# EAGLE design pcb (EAGLE 8.0.1)
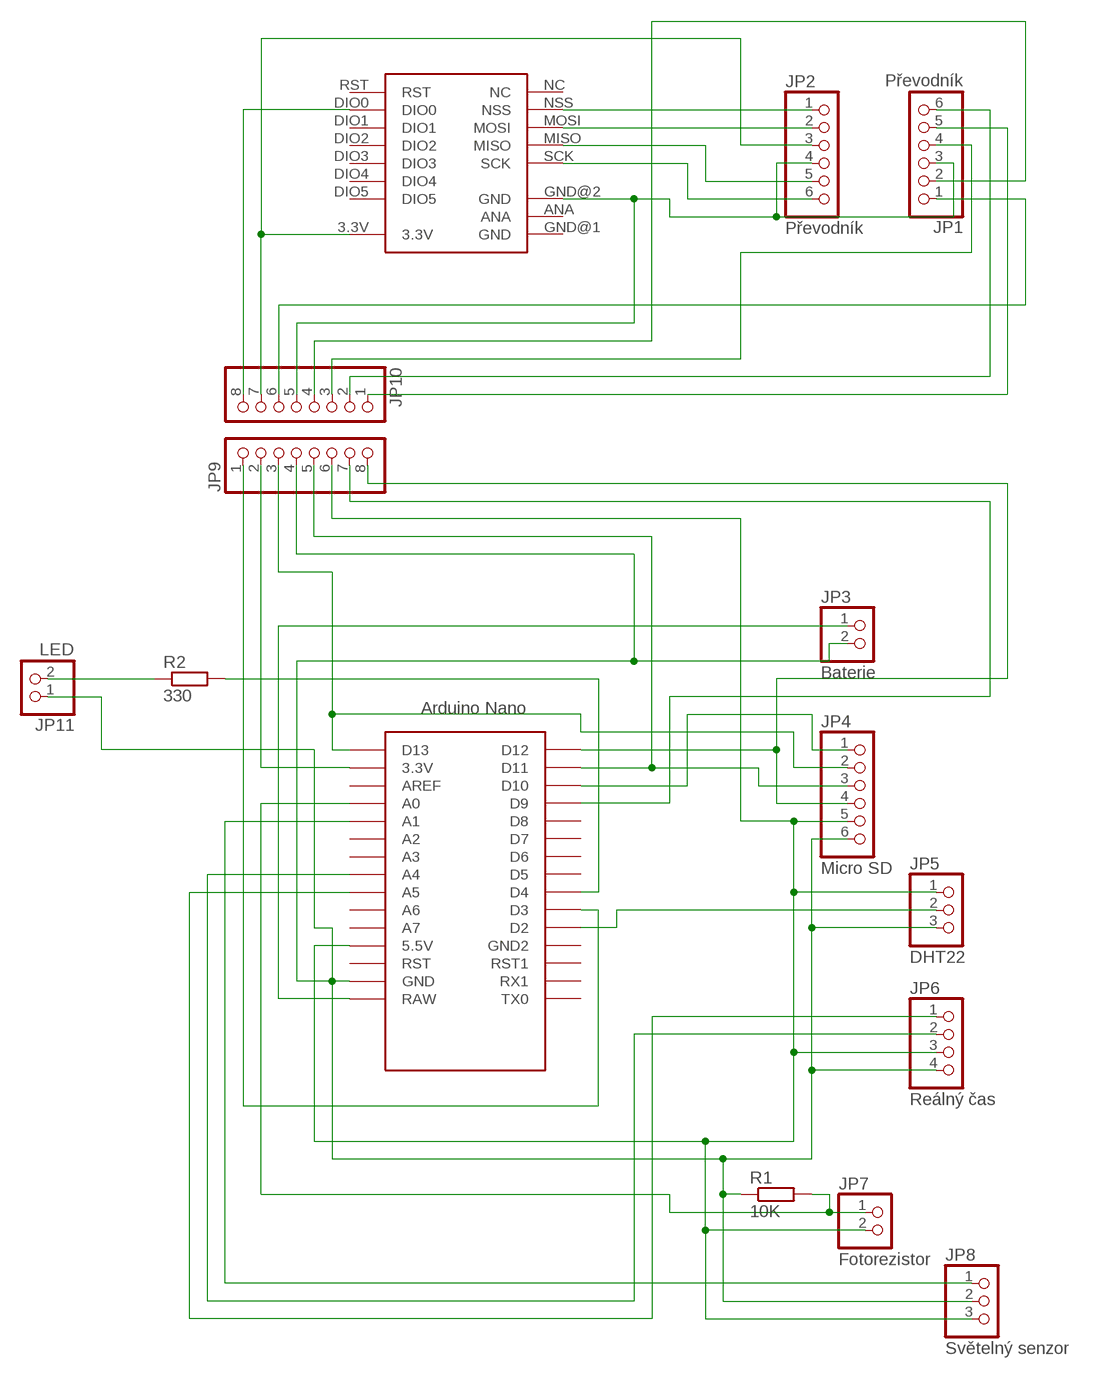
[diagram p0: schematic, sheet 1]

## Parts
JP1  Převodník  PINHD-1X6  [1X06]
JP2  Převodník  PINHD-1X6  [1X06]
JP3  Baterie  PINHD-1X2  [1X02]
JP4  Micro SD  PINHD-1X6  [1X06]
JP5  DHT22  PINHD-1X3  [1X03]
JP6  Reálný čas  PINHD-1X4  [1X04]
JP7  Fotorezistor  PINHD-1X2  [1X02]
JP8  Světelný senzor  PINHD-1X3  [1X03]
JP9  PINHD-1X8  [1X08]
JP10  PINHD-1X8  [1X08]
JP11  LED  PINHD-1X2  [1X02]
R1  10K  R-EU_0204/7  [0204/7]
R2  330  R-EU_0204/7  [0204/7]
RFM69  RFM69  [20X16BOARD]
U$1  NANO  [NANO]

## Nets
N$1: JP4.5 JP5.1 JP6.3 JP7.2 JP8.3 JP9.6 U$1.5V(5.5V)
N$2: JP3.2 JP4.6 JP5.3 JP6.4 JP8.2 JP9.4 JP11.1 R1.1 U$1.GND
N$3: JP4.4 JP9.8 U$1.D12
N$4: JP1.2 JP10.4
N$5: JP1.1 JP10.6
N$6: JP4.1 U$1.D10
N$7: JP3.1 U$1.RAW
N$8: JP5.2 U$1.D2
N$9: JP2.5 RFM69.MISO
N$10: JP2.6 RFM69.SCK
N$11: JP2.2 RFM69.MOSI
N$12: JP2.1 RFM69.NSS
N$13: JP2.3 JP10.7 RFM69.3.3V
N$14: JP9.1 U$1.D3
N$15: JP8.1 U$1.A1
N$16: JP7.1 R1.2 U$1.A0
N$17: JP9.7 U$1.D9
N$18: JP6.2 U$1.A4
N$19: JP6.1 U$1.A5
N$20: JP10.8 RFM69.DIO0
N$21: JP9.2 U$1.3.3V
N$22: JP4.2 JP9.3 U$1.D13
N$23: JP1.3 JP2.4 JP10.5 RFM69.GND@2(GND)
N$24: JP4.3 JP9.5 U$1.D11
N$25: JP1.4 JP10.3
N$26: JP1.6 JP10.2
N$27: JP1.5 JP10.1
N$29: JP11.2 R2.1
N$30: R2.2 U$1.D4
Unconnected: RFM69.ANA RFM69.DIO1 RFM69.DIO2 RFM69.DIO3 RFM69.DIO4 RFM69.DIO5 RFM69.RST U$1.A2 U$1.A3 U$1.A6 U$1.A7 U$1.AREF U$1.D5 U$1.D6 U$1.D7 U$1.D8 U$1.GND1(GND2) U$1.ICSP1 U$1.ICSP2 U$1.ICSP3 U$1.ICSP4 U$1.ICSP5 U$1.ICSP6 U$1.RST U$1.RST1 U$1.RX1 U$1.TX0

## Power pins joined to a net without a drawn wire
GND: RFM69.GND@1(GND)
NC: RFM69.NC

## Library data of the parts
JP1 JP2 JP4 = pinhead:PINHD-1X6: PIN HEADER
JP3 JP7 JP11 = pinhead:PINHD-1X2: PIN HEADER
JP5 JP8 = pinhead:PINHD-1X3: PIN HEADER
JP6 = pinhead:PINHD-1X4: PIN HEADER
JP9 JP10 = pinhead:PINHD-1X8: PIN HEADER
R1 R2 = resistor:R-EU_: RESISTOR, European symbol
RFM69 = RFM69mod:RFM69: RFM69 module
U$1 = Arduino-clone:NANO: Arduino Nano

## Board
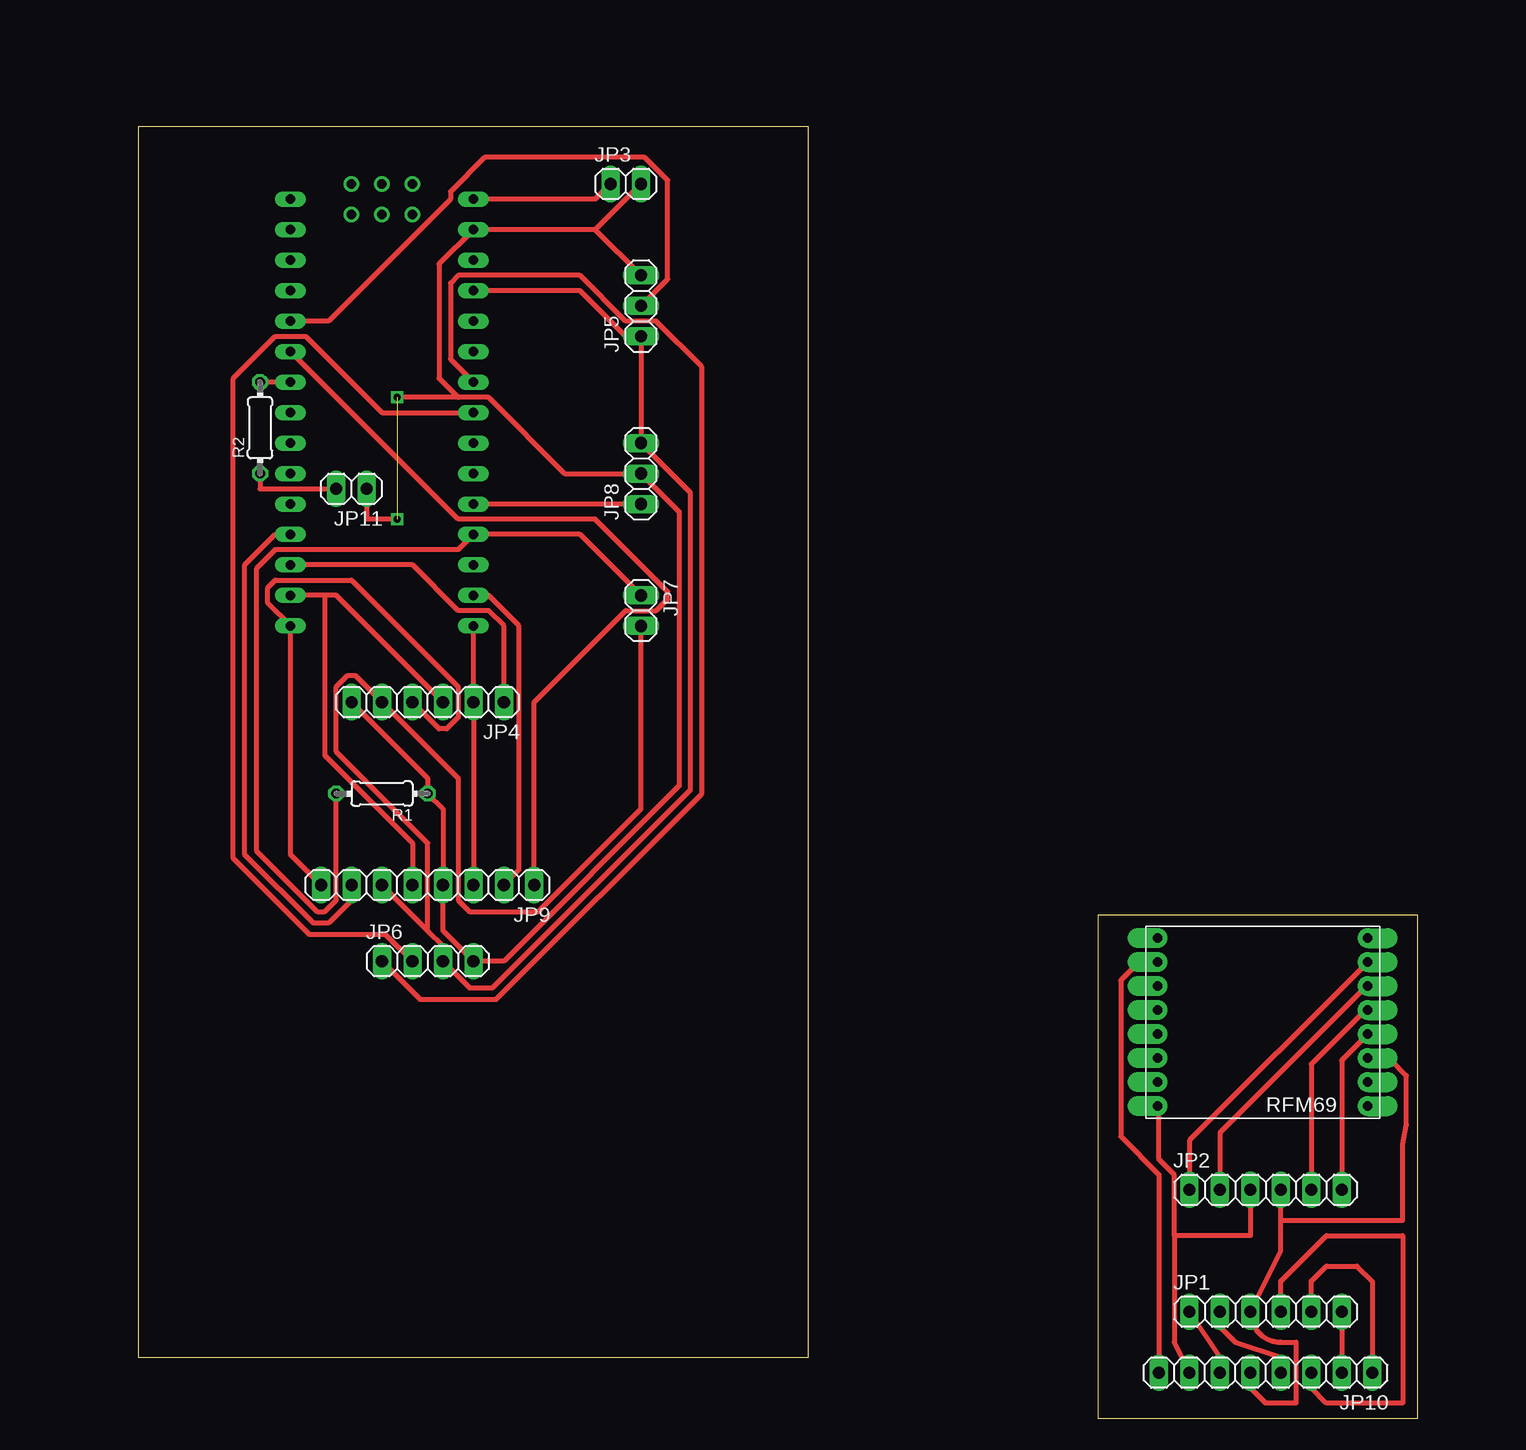
[diagram p1: board, top side]
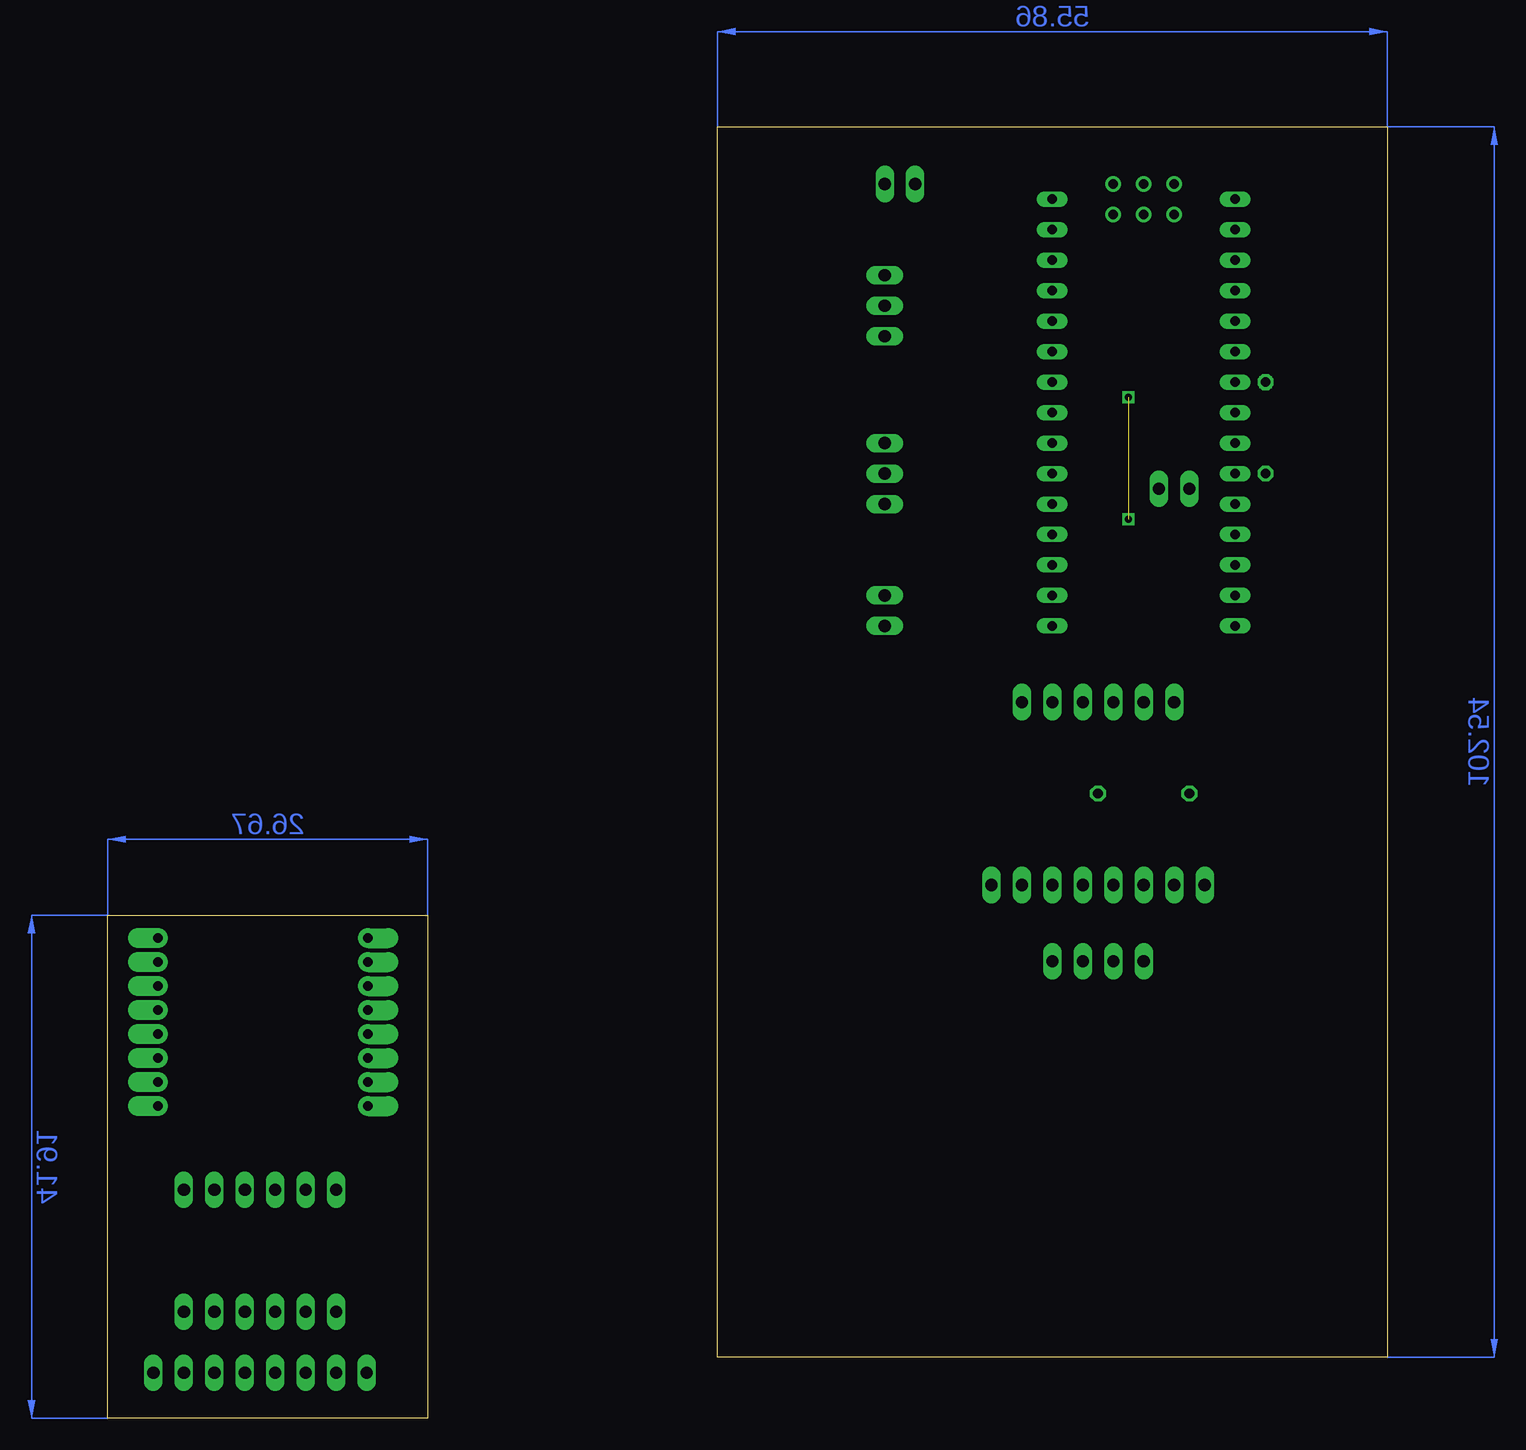
[diagram p2: board, bottom side, seen from below]

Size 106.68 x 107.62 mm. Coordinates in mm from the lower left corner, seen from the top.
Outline: 0,5.08 55.86,5.08 55.86,107.62 0,107.62 0,5.08
Outline: 80.01,41.91 80.01,0 106.68,0 106.68,41.91 80.01,41.91
Copper layers (1*16): Top 0.035mm / dielectric 1.5mm / Bottom 0.035mm
Design rules "default *": minimum track width 17mil, minimum drill 24mil, track to track 17mil, track to pad 10mil, pad to pad 10mil, via to via 10mil, smd to smd 8mil, copper to edge 40mil, drill to drill 8mil, minimum pad ring 10mil, minimum via ring 8mil, stop-mask expansion 4mil, vias tented up to drill 0mil, thermal gap 10mil

### Footprints (pad centres in the part's own frame; a part is rotated, then mirrored left to right if it is on the bottom)
1X06 = drill 1.016 long: 1 -6.35,0; 2 -3.81,0; 3 -1.27,0; 4 1.27,0; 5 3.81,0; 6 6.35,0
1X02 = drill 1.016 long: 1 -1.27,0; 2 1.27,0
1X03 = drill 1.016 long: 1 -2.54,0; 2 0,0; 3 2.54,0
1X04 = drill 1.016 long: 1 -3.81,0; 2 -1.27,0; 3 1.27,0; 4 3.81,0
1X08 = drill 1.016 long: 1 -8.89,0; 2 -6.35,0; 3 -3.81,0; 4 -1.27,0; 5 1.27,0; 6 3.81,0; 7 6.35,0; 8 8.89,0
0204/7 = drill 0.813 octagon: 1 -3.81,0; 2 3.81,0
20X16BOARD = drill 0.8 pad 1.676 offset: 3.3V -9,-7; ANA 8.5,-5; DIO0 -9,5; DIO1 -9,3; DIO2 -9,1; DIO3 -9,-1; DIO4 -9,-3; DIO5 -9,-5; GND@1 8.5,-7; GND@2 8.5,-3; MISO 8.5,1; MOSI 8.5,3; NC 8.5,7; NSS 8.5,5; RST -9,7; SCK 8.5,-1
NANO = drill 0.8 long: 3.3V -10.16,24.13; 5V -10.16,-1.27; A0 -10.16,19.05; A1 -10.16,16.51; A2 -10.16,13.97; A3 -10.16,11.43; A4 -10.16,8.89; A5 -10.16,6.35; A6 -10.16,3.81; A7 -10.16,1.27; AREF -10.16,21.59; D2 5.08,1.27; D3 5.08,3.81; D4 5.08,6.35; D5 5.08,8.89; D6 5.08,11.43; D7 5.08,13.97; D8 5.08,16.51; D9 5.08,19.05; D10 5.08,21.59; D11 5.08,24.13; D12 5.08,26.67; D13 -10.16,26.67; GND -10.16,-6.35; GND1 5.08,-1.27; RAW -10.16,-8.89; RST -10.16,-3.81; RST1 5.08,-3.81; RX1 5.08,-6.35; TX0 5.08,-8.89 | drill 0.8: ICSP1 -5.08,-10.16; ICSP2 -5.08,-7.62; ICSP3 -2.54,-10.16; ICSP4 -2.54,-7.62; ICSP5 0,-10.16; ICSP6 0,-7.62

### Placement (x,y rotation side)
JP1  93.98,8.89 0 top
JP2  93.98,19.05 0 top
JP3  40.64,102.87 0 top
JP4  24.13,59.69 180 top
JP5  41.91,92.71 90 top
JP6  24.13,38.1 0 top
JP7  41.91,67.31 270 top
JP8  41.91,78.74 90 top
JP9  24.13,44.45 180 top
JP10  93.98,3.81 180 top
JP11  17.78,77.47 180 top
R1  20.32,52.07 180 top
R2  10.16,82.55 90 top
RFM69  93.98,33.02 0 top
U$1  17.78,92.71 180 top

### Tracks (layer width: path | path; a pad name or v marks a point on that pad's centre or on a via)
N$1
  Top 0.432: U$1.5V 36.83,93.98 40.64,90.17 JP5.1 JP8.3 46.04,77.15 46.04,52.39 29.53,35.88 27.62,35.88 JP6.3 25.4,39.37 24.13,40.64 | JP9.6 24.13,40.64 | 24.13,40.64 24.13,47.94 16.51,55.56 16.51,60.96 17.46,61.91 18.1,61.91 JP4.5 26.67,53.34 26.67,43.18 27.62,42.23 33.34,42.23 41.91,50.8 JP7.2
N$2  (via drill 0.6)  (1 unrouted)
  Top 0.406: JP11.1 19.05,74.93 v21.59,74.93 | 26.67,85.09 v21.59,85.09
  Top 0.432: JP4.6 24.13,53.34 R1.1 25.4,50.8 JP9.4 25.4,40.64 JP6.4 30.48,38.1 45.09,52.7 45.09,75.56 JP8.2 35.56,78.74 29.21,85.09 26.67,85.09 25.08,86.68 25.08,96.2 U$1.GND 38.1,99.06 | JP3.2 38.1,99.06 | 38.1,99.06 JP5.3
N$3
  Top 0.432: JP9.8 12.7,46.99 U$1.D12 10.79,67.95 10.79,69.22 11.43,69.85 17.78,69.85 26.67,60.96 26.67,58.42 25.72,57.47 25.08,57.47 JP4.4
N$4
  Top 0.406: 90.17,7.62 91.44,6.35 95.25,5.08 JP10.4
  Top 0.432: 90.17,7.62 JP1.2
N$5
  Top 0.432: JP10.6 90.17,5.08 JP1.1
N$6
  Top 0.432: U$1.D10 22.86,71.12 26.67,67.31 29.21,67.31 30.48,66.04 JP4.1
N$7
  Top 0.432: U$1.RAW 38.1,101.6 JP3.1
N$8
  Top 0.432: U$1.D2 15.88,91.44 26.04,101.6 26.04,102.23 28.89,105.09 42.23,105.09 44.13,103.19 44.13,94.93 JP5.2
N$9
  Top 0.432: JP2.5 97.79,29.53 102.23,33.97 RFM69.MISO
N$10
  Top 0.432: JP2.6 100.33,29.85 102.23,31.75 RFM69.SCK
N$11
  Top 0.432: JP2.2 90.17,23.81 102.23,35.88 RFM69.MOSI
N$12
  Top 0.432: JP2.1 87.63,23.18 102.23,37.78 RFM69.NSS
N$13
  Top 0.406: JP2.3 92.71,15.24 86.36,15.24
  Top 0.432: JP10.7 86.36,6.35 86.36,15.24 86.36,20.32 85.09,21.59 85.09,25.72 RFM69.3.3V
N$14
  Top 0.432: U$1.D3 26.67,74.93 38.1,74.93 44.13,68.9 44.13,68.26 43.18,67.31 40.64,67.31 33.02,59.69 JP9.1
N$15
  Top 0.432: JP8.1 U$1.A1
N$16
  Top 0.432: JP7.1 36.83,73.66 U$1.A0 26.67,72.39 11.43,72.39 9.84,70.8 9.84,47.31 14.92,42.23 15.56,42.23 16.51,43.18 R1.2
N$17
  Top 0.432: U$1.D9 11.43,73.66 8.89,71.12 8.89,46.99 14.61,41.27 15.88,41.27 17.78,43.18 JP9.7
N$18
  Top 0.432: U$1.A4 20.32,83.82 13.97,90.17 11.43,90.17 7.94,86.68 7.94,46.67 14.29,40.32 20.64,40.32 JP6.2
N$19
  Top 0.432: U$1.A5 26.04,88.27 26.04,94.62 26.67,95.25 36.83,95.25 40.64,91.44 43.18,91.44 46.99,87.63 46.99,52.07 29.84,34.92 23.5,34.92 JP6.1
N$20
  Top 0.432: JP10.8 85.09,20.32 81.92,23.5 81.92,36.51 83.19,37.78 84.77,37.78 RFM69.DIO0
N$21
  Top 0.432: U$1.3.3V 29.21,68.58 31.75,66.04 31.75,45.72 JP9.2
N$22
  Top 0.432: U$1.D13 JP4.2 JP9.3
N$23
  Top 0.406: JP1.3 arc90 95.25,6.35 96.52,6.35 96.52,1.27 93.98,1.27 92.71,2.54 JP10.5 | 95.25,16.51 105.41,16.51 105.41,22.86 105.73,24.45
  Top 0.432: JP2.4 95.25,16.51 95.25,13.97 JP1.3 | 105.73,24.45 105.73,28.57 104.46,29.85 102.55,29.85 RFM69.GND@2
N$24
  Top 0.432: 15.56,68.58 16.51,68.58 JP4.3 | 15.56,68.58 U$1.D11 | JP9.5 22.86,47.94 15.56,55.24 15.56,68.58
N$25
  Top 0.406: JP1.4 95.25,11.43 99.06,15.24 105.41,15.24 105.41,1.27 99.06,1.27 97.79,2.54 JP10.3
N$26
  Top 0.432: JP1.6 JP10.2
N$27
  Top 0.406: JP1.5 97.79,11.43 99.06,12.7 101.6,12.7 102.87,11.43
  Top 0.432: 102.87,11.43 JP10.1
N$29
  Top 0.406: R2.1 10.16,77.47 JP11.2
N$30  (via drill 0.6)
  Top 0.406: U$1.D4 R2.2
  other vias: 10.16,86.36
(copper drawn outside any net)
  shapes: Bottom area x4